# Altium schematic sheet 15.SchDoc
size 297 x 209 mm
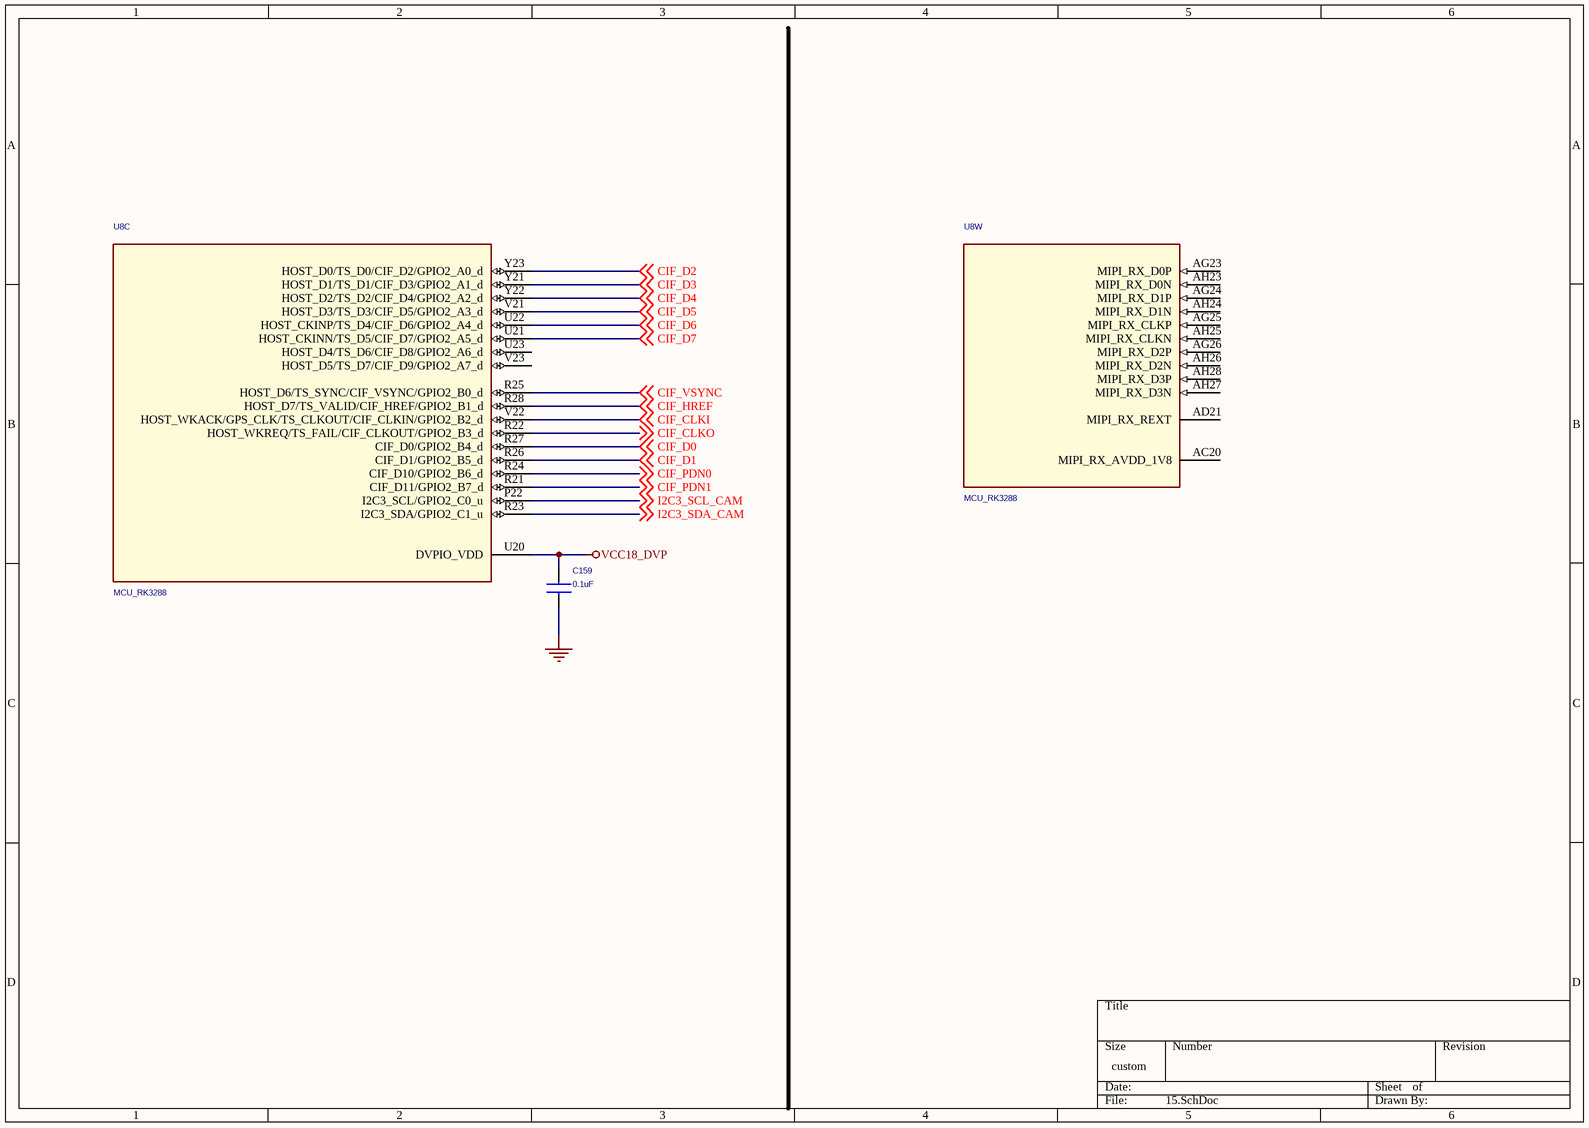
[diagram p0: 15.SchDoc]

## Parts
C159  0.1uF  [C0603]
U8  MCU_RK3288  [BGA453-19X19]  (parts C,W of 24)

## Nets
GND: C159.2
VCC18_DVP: C159.1 U8.U20(DVPIO_VDD)
CIF_CLKI: U8.V22(HOST_WKACK/GPS_CLK/TS_CLKOUT/CIF_CLKIN/GPIO2_B2_d) ; off-sheet CIF_CLKI
CIF_CLKO: U8.R22(HOST_WKREQ/TS_FAIL/CIF_CLKOUT/GPIO2_B3_d) ; off-sheet CIF_CLKO
CIF_D0: U8.R27(CIF_D0/GPIO2_B4_d) ; off-sheet CIF_D0
CIF_D1: U8.R26(CIF_D1/GPIO2_B5_d) ; off-sheet CIF_D1
CIF_D2: U8.Y23(HOST_D0/TS_D0/CIF_D2/GPIO2_A0_d) ; off-sheet CIF_D2
CIF_D3: U8.Y21(HOST_D1/TS_D1/CIF_D3/GPIO2_A1_d) ; off-sheet CIF_D3
CIF_D4: U8.Y22(HOST_D2/TS_D2/CIF_D4/GPIO2_A2_d) ; off-sheet CIF_D4
CIF_D5: U8.V21(HOST_D3/TS_D3/CIF_D5/GPIO2_A3_d) ; off-sheet CIF_D5
CIF_D6: U8.U22(HOST_CKINP/TS_D4/CIF_D6/GPIO2_A4_d) ; off-sheet CIF_D6
CIF_D7: U8.U21(HOST_CKINN/TS_D5/CIF_D7/GPIO2_A5_d) ; off-sheet CIF_D7
CIF_HREF: U8.R28(HOST_D7/TS_VALID/CIF_HREF/GPIO2_B1_d) ; off-sheet CIF_HREF
CIF_PDN0: U8.R24(CIF_D10/GPIO2_B6_d) ; off-sheet CIF_PDN0
CIF_PDN1: U8.R21(CIF_D11/GPIO2_B7_d) ; off-sheet CIF_PDN1
CIF_VSYNC: U8.R25(HOST_D6/TS_SYNC/CIF_VSYNC/GPIO2_B0_d) ; off-sheet CIF_VSYNC
I2C3_SCL_CAM: U8.P22(I2C3_SCL/GPIO2_C0_u) ; off-sheet I2C3_SCL_CAM
I2C3_SDA_CAM: U8.R23(I2C3_SDA/GPIO2_C1_u) ; off-sheet I2C3_SDA_CAM

Not connected (* = marked no-connect by the designer): U8 AC20(MIPI_RX_AVDD_1V8) AD21(MIPI_RX_REXT) AG23(MIPI_RX_D0P) AG24(MIPI_RX_D1P) AG25(MIPI_RX_CLKP) AG26(MIPI_RX_D2P) AH23(MIPI_RX_D0N) AH24(MIPI_RX_D1N) AH25(MIPI_RX_CLKN) AH26(MIPI_RX_D2N) AH27(MIPI_RX_D3N) AH28(MIPI_RX_D3P) U23(HOST_D4/TS_D6/CIF_D8/GPIO2_A6_d) V23(HOST_D5/TS_D7/CIF_D9/GPIO2_A7_d)

## Library data of the parts
C159 = CAP NP_Dup3: CAP,MLCC,1uF,+/-10%,X5R,6.3V,SMD0402
U8 = MCU_RK3288_3